# EAGLE design interface_board (EAGLE 8.1.1)

## Sheet 1 of 2
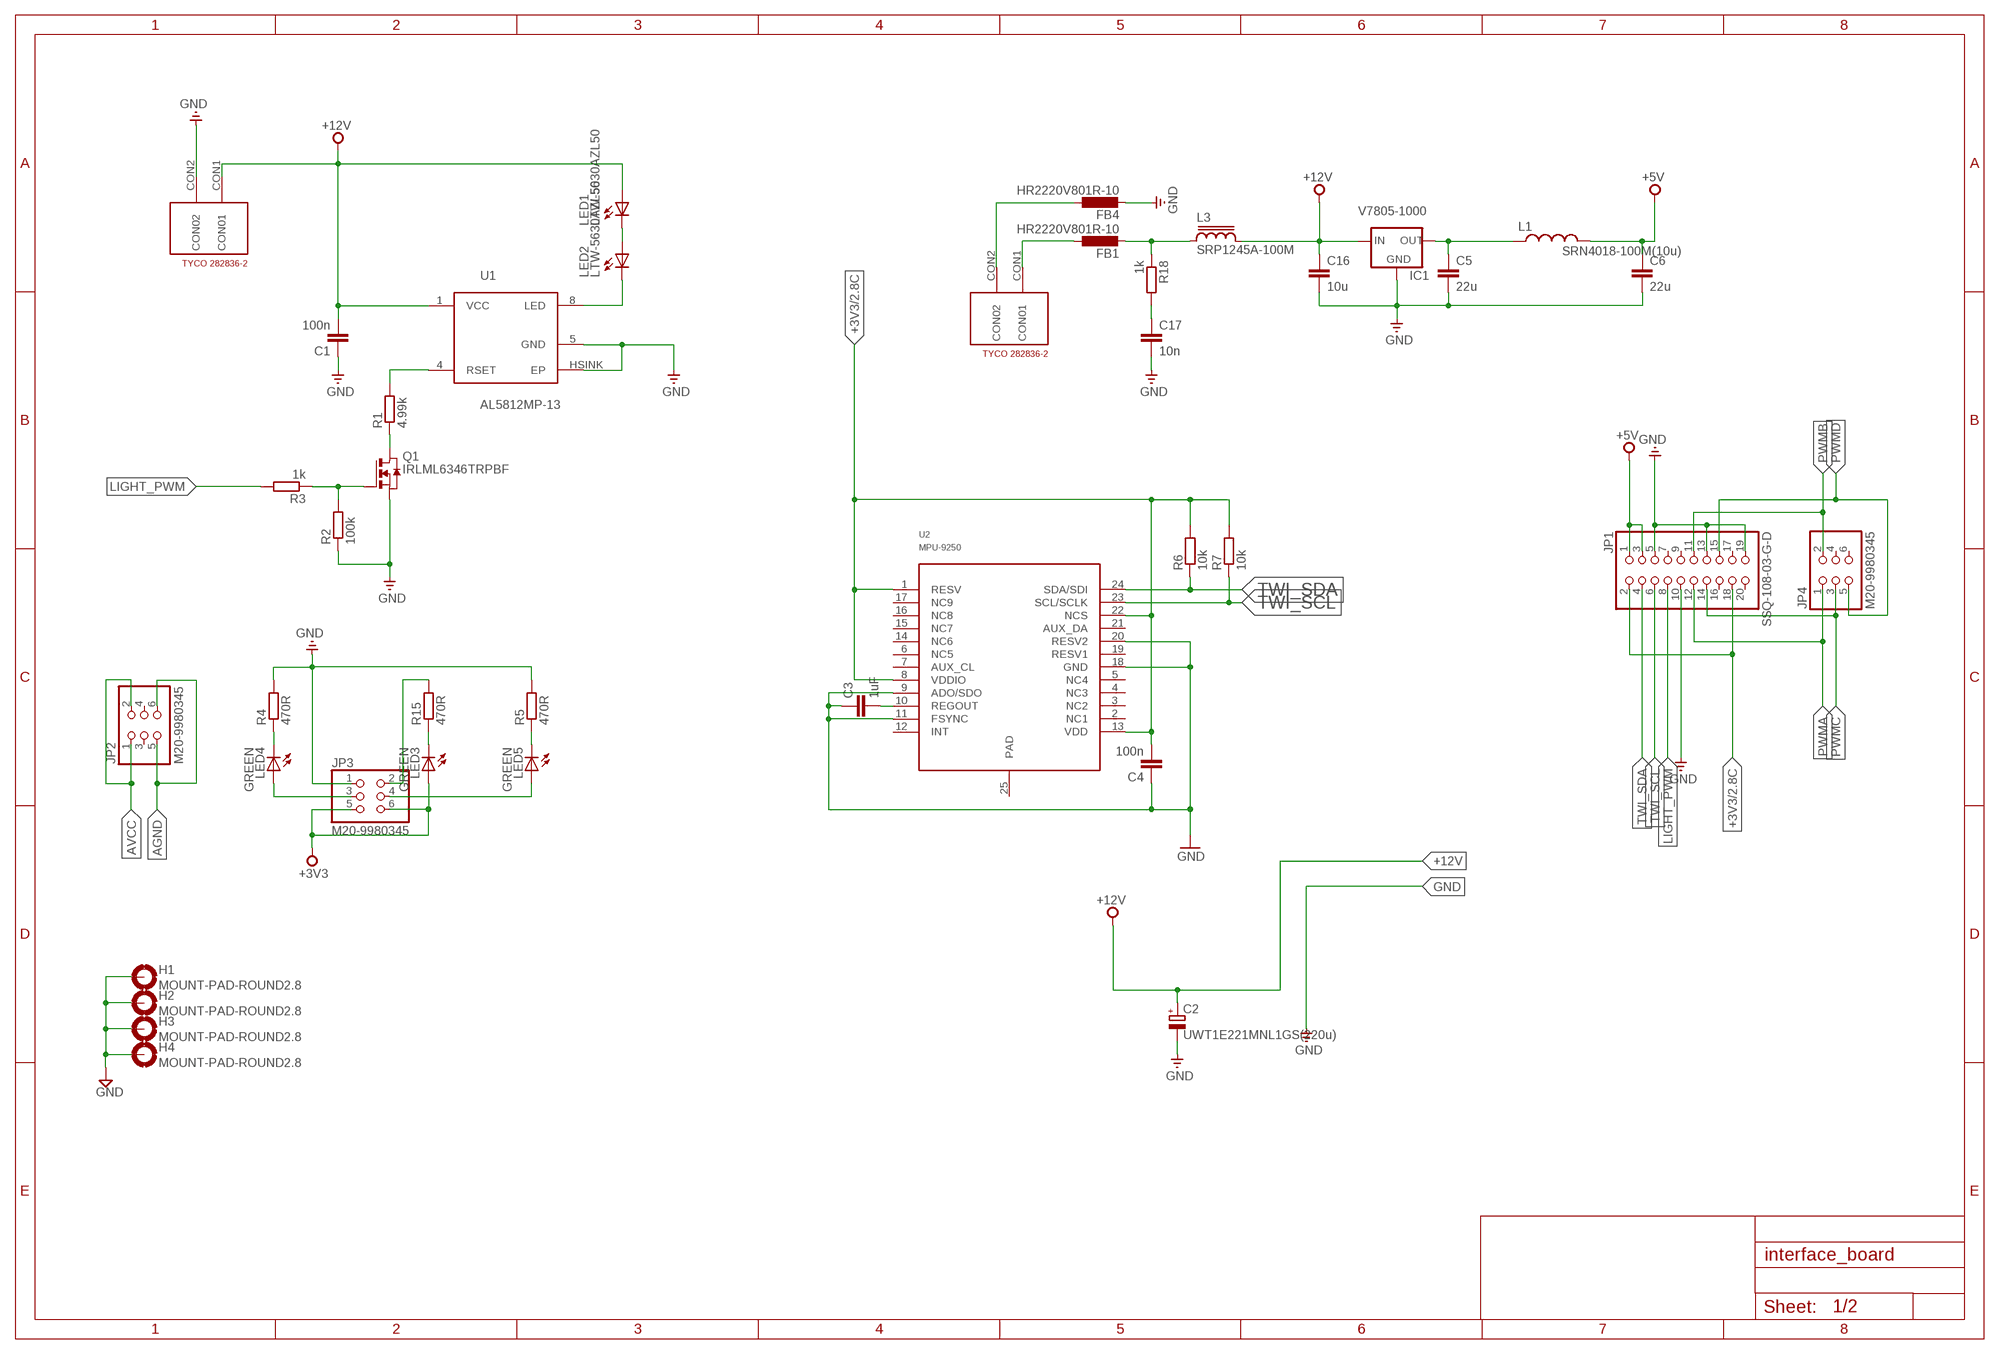
[diagram p0: schematic, sheet 1]

### Parts
C1  100n  C-EUC0402  [C0402]
C2  UWT1E221MNL1GS(220u)  CPOL-EU153CLV-0810  [153CLV-0810]
C3  1uF  C-EUC0402  [C0402]
C4  100n  C-EUC0402  [C0402]
C5  22u  C-EUC0603  [C0603]
C6  22u  C-EUC0603  [C0603]
C16  10u  C-EUC0603  [C0603]
C17  10n  C-EUC0402  [C0402]
FB1  HR2220V801R-10  L-EUL5650M  [L5650M]
FB4  HR2220V801R-10  L-EUL5650M  [L5650M]
H1  MOUNT-PAD-ROUND2.8  [2,8-PAD]
H2  MOUNT-PAD-ROUND2.8  [2,8-PAD]
H3  MOUNT-PAD-ROUND2.8  [2,8-PAD]
H4  MOUNT-PAD-ROUND2.8  [2,8-PAD]
IC1  V7805-1000  VR_1OUTXX  [DIP_3PIN]
JP1  SSQ-108-03-G-D  PINHD-2X10  [2X10]
JP2  M20-9980345  PINHD-2X3  [2X03]
JP3  M20-9980345  PINHD-2X3  [2X03]
JP4  M20-9980345  PINHD-2X3  [2X03]
L1  SRN4018-100M(10u)  BOURNS-SRN4018  [BOURNS-SRN4018]
L3  SRP1245A-100M  SRP1250A  [SRP1250A]
LED1  LTW-5630AZL50  LTW-5630AZL  [LITEON-5630]
LED2  LTW-5630AZL50  LTW-5630AZL  [LITEON-5630]
LED3  GREEN  LEDCHIP-LED0603  [CHIP-LED0603]
LED4  GREEN  LEDCHIP-LED0603  [CHIP-LED0603]
LED5  GREEN  LEDCHIP-LED0603  [CHIP-LED0603]
Q1  IRLML6346TRPBF  NMOS-FETSOT23  [SOT23]
R1  4.99k  R-EU_R0402  [R0402]
R2  100k  R-EU_R0402  [R0402]
R3  1k  R-EU_R0402  [R0402]
R4  470R  R-EU_R0402  [R0402]
R5  470R  R-EU_R0402  [R0402]
R6  10k  R-EU_R0402  [R0402]
R7  10k  R-EU_R0402  [R0402]
R15  470R  R-EU_R0402  [R0402]
R18  1k  R-EU_R0402  [R0402]
U1  AL5812MP-13  [MSOP-8EP]
U2  MPU-9250  [LEAD-QFN24]
U$2  282836-2  [282836-2]
U$4  282836-2  [282836-2]

### Nets
+3V3: C4.2 JP1.2 JP1.18 JP3.5 JP3.6 LED3.A R6.2 R7.2 U2.1(RESV) U2.8(VDDIO) U2.13(VDD) U2.22(NCS) ; also sheet 2
+5V [VCC]: C6.1 JP1.1 JP1.3 L1.P$1 ; also sheet 2
+12V [VCC]: C1.2 C2.+ C16.1 IC1.IN L3.2 LED1.A1(A) LED1.A2(A) LED1.A3(A) U1.1(VCC) U$4.CON1(CON01)
AGND [GND]: FB4.1 JP2.5 JP2.6 U$2.CON2(CON02)
AVCC: FB1.1 JP2.1 JP2.2 U$2.CON1(CON01)
GND [GND]: C1.1 C2.- C3.1 C4.1 C5.2 C6.2 C16.2 C17.2 FB4.2 H1.B2,8(MOUNT) H2.B2,8(MOUNT) H3.B2,8(MOUNT) H4.B2,8(MOUNT) IC1.GND JP1.5 JP1.10 JP1.13 JP1.19 JP3.1 Q1.2(S) R2.1 R4.2 R5.2 U1.5(GND) U1.HSINK(EP) U2.9(ADO/SDO) U2.11(FSYNC) U2.18(GND) U2.20(RESV2) U$4.CON2(CON02) ; also sheet 2
LIGHT_PWM: JP1.8 R3.2
N$1: LED1.C1(C) LED1.C2(C) LED2.A1(A) LED2.A2(A) LED2.A3(A)
N$2: LED4.C R4.1
N$3 [VCC]: FB1.2 L3.1 R18.1
N$4: C3.2 U2.10(REGOUT)
N$5: R1.2 U1.4(RSET)
N$6: Q1.3(D) R1.1
N$7: Q1.1(G) R2.2 R3.1
N$8: JP3.3 LED4.A
N$9: LED2.C1(C) LED2.C2(C) U1.8(LED)
N$10 [VCC]: C5.1 IC1.OUT L1.P$2
N$11: JP3.4 LED5.A
N$12: LED5.C R5.1
N$13 [GND]: JP3.2 R15.2
N$14: LED3.C R15.1
N$38: C17.1 R18.2
PWMA: JP1.12 JP4.1
PWMB: JP1.11 JP4.2
PWMC: JP1.14 JP4.3
PWMD: JP1.15 JP4.5
TWI_SCL: JP1.6 R7.1 U2.23(SCL/SCLK)
TWI_SDA: JP1.4 R6.1 U2.24(SDA/SDI)
Unconnected: JP1.7 JP1.9 JP1.16 JP1.17 JP1.20 JP2.3 JP2.4 JP4.4 JP4.6 U2.2(NC1) U2.3(NC2) U2.4(NC3) U2.5(NC4) U2.6(NC5) U2.7(AUX_CL) U2.12(INT) U2.14(NC6) U2.15(NC7) U2.16(NC8) U2.17(NC9) U2.19(RESV1) U2.21(AUX_DA) U2.25(PAD)

### Notes on the sheet
- Hole

## Sheet 2 of 2
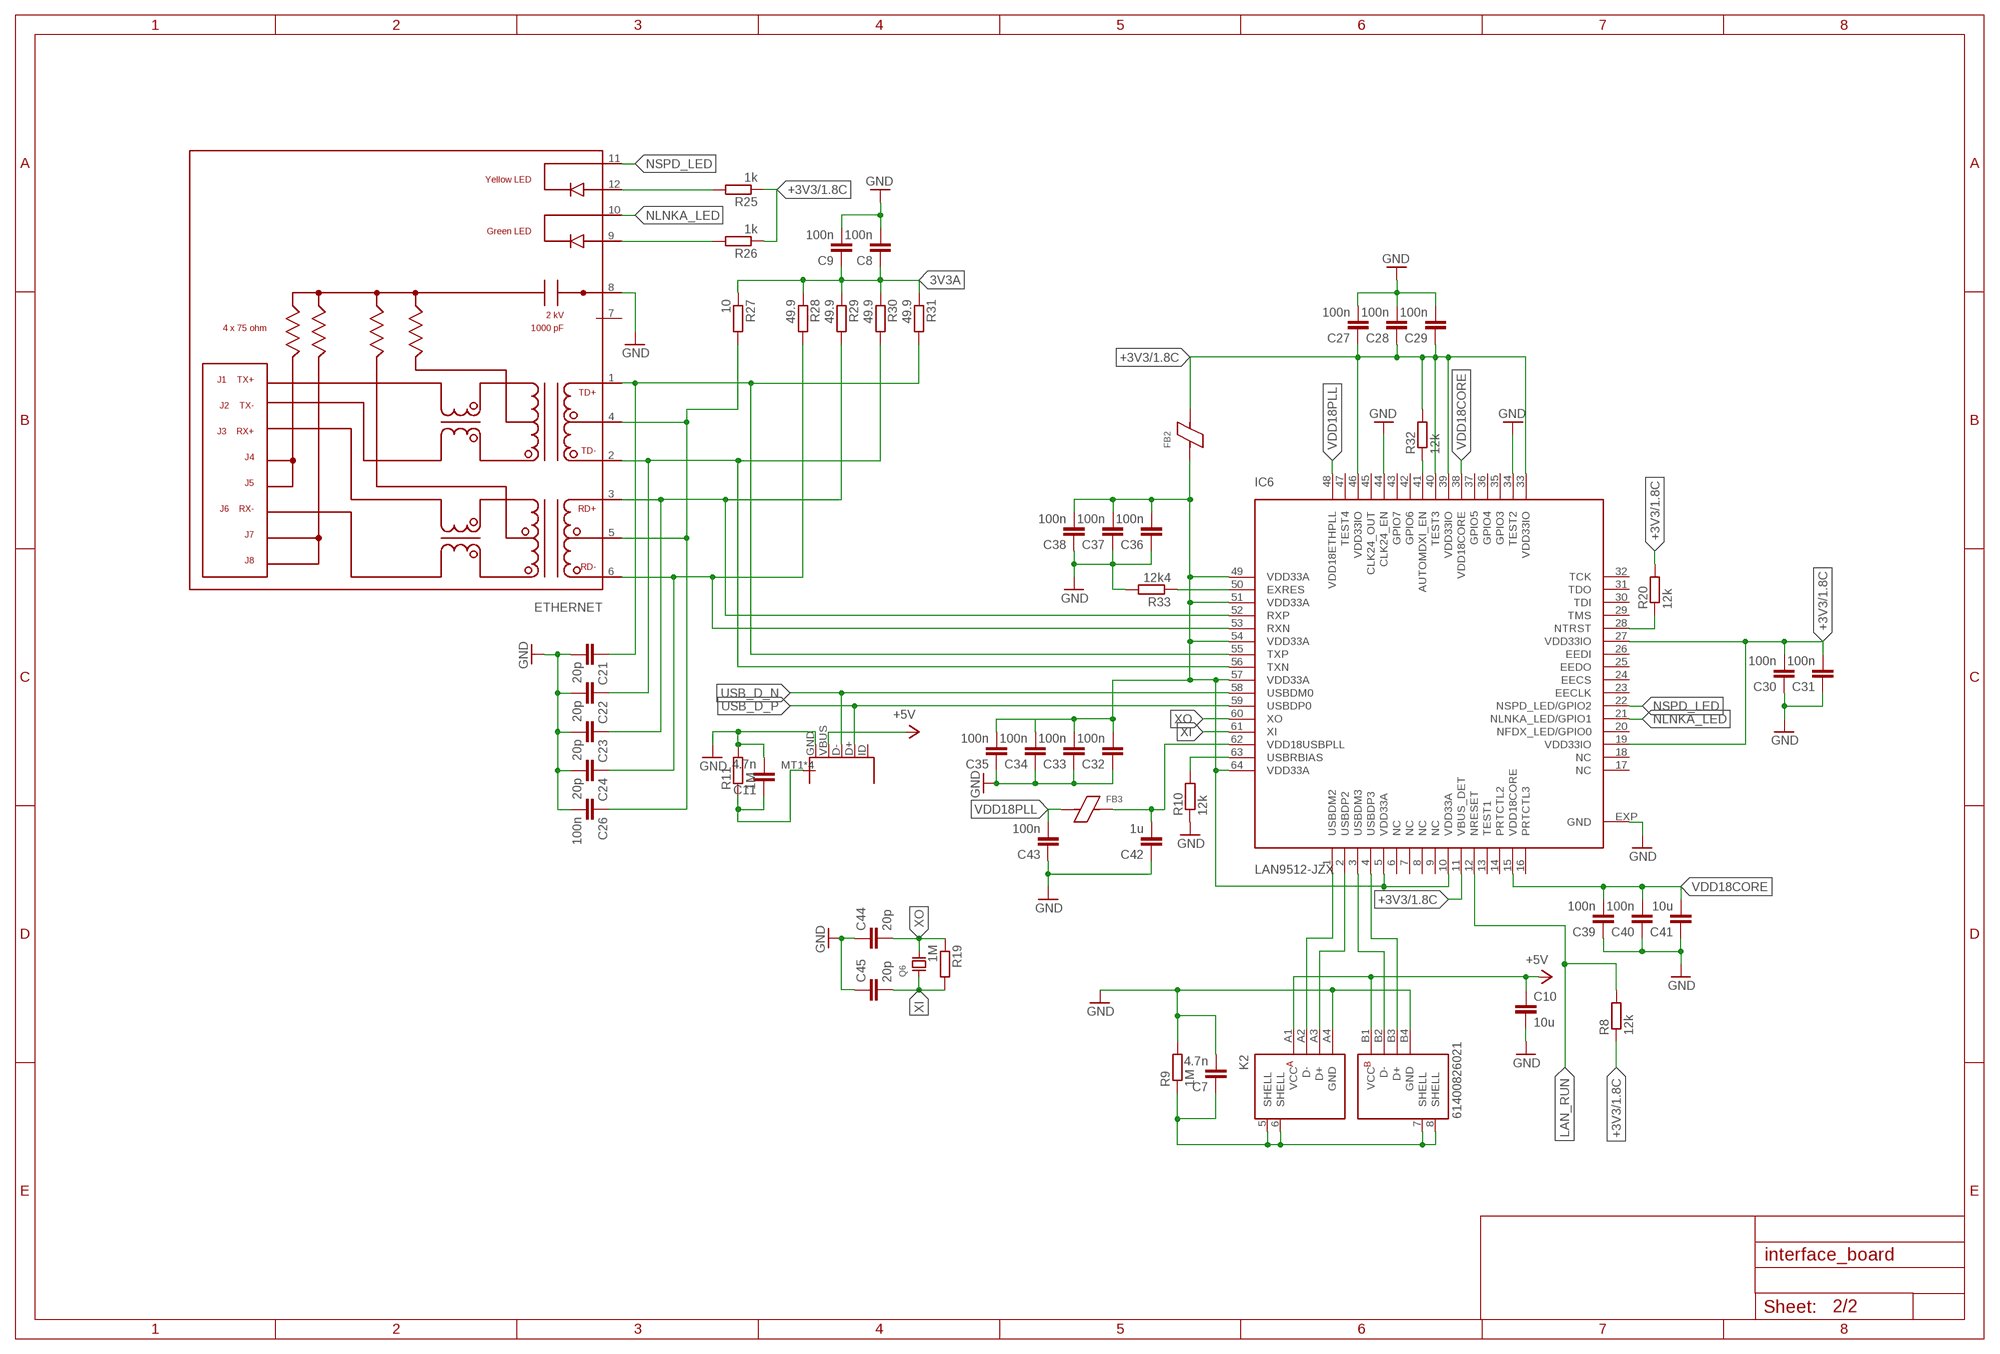
[diagram p1: schematic, sheet 2]

### Parts
C7  4.7n  C-EUC0402  [C0402]
C8  100n  C-EUC0402  [C0402]
C9  100n  C-EUC0402  [C0402]
C10  10u  C-EUC0603  [C0603]
C11  4.7n  C-EUC0402  [C0402]
C21  20p  C-EUC0402  [C0402]
C22  20p  C-EUC0402  [C0402]
C23  20p  C-EUC0402  [C0402]
C24  20p  C-EUC0402  [C0402]
C26  100n  C-EUC0402  [C0402]
C27  100n  C-EUC0402  [C0402]
C28  100n  C-EUC0402  [C0402]
C29  100n  C-EUC0402  [C0402]
C30  100n  C-EUC0402  [C0402]
C31  100n  C-EUC0402  [C0402]
C32  100n  C-EUC0402  [C0402]
C33  100n  C-EUC0402  [C0402]
C34  100n  C-EUC0402  [C0402]
C35  100n  C-EUC0402  [C0402]
C36  100n  C-EUC0402  [C0402]
C37  100n  C-EUC0402  [C0402]
C38  100n  C-EUC0402  [C0402]
C39  100n  C-EUC0402  [C0402]
C40  100n  C-EUC0402  [C0402]
C41  10u  C-EUC0603  [C0603]
C42  1u  C-EUC0402  [C0402]
C43  100n  C-EUC0402  [C0402]
C44  20p  C-EUC0402  [C0402]
C45  20p  C-EUC0402  [C0402]
ETHERNET  HR911105A  [RJ45]
FB2  742792022  FERRITE_BEAD  [C0805]
FB3  742792022  FERRITE_BEAD  [C0805]
IC6  LAN9512-JZX  LAN9512  [QFN64-9X9]
JP6  10118192-0001LF  USB-IDMICRO  [USB-MICRO]
K2  61400826021  [61400826021]
Q6  FA-238 25.0000MB  CTS_32X25_SMD  [CTS_32X25]
R8  12k  R-EU_R0402  [R0402]
R9  1M  R-EU_R0402  [R0402]
R10  12k  R-EU_R0402  [R0402]
R11  1M  R-EU_R0402  [R0402]
R19  1M  R-EU_R0402  [R0402]
R20  12k  R-EU_R0402  [R0402]
R25  1k  R-EU_R0402  [R0402]
R26  1k  R-EU_R0402  [R0402]
R27  10  R-EU_R0402  [R0402]
R28  49.9  R-EU_R0402  [R0402]
R29  49.9  R-EU_R0402  [R0402]
R30  49.9  R-EU_R0402  [R0402]
R31  49.9  R-EU_R0402  [R0402]
R32  12k  R-EU_R0402  [R0402]
R33  12k4  R-EU_R0402  [R0402]

### Nets
3V3A: C8.1 C9.1 C32.2 C33.2 C34.2 C35.2 C36.2 C37.2 C38.2 FB2.1 IC6.5(VDD33A) IC6.10(VDD33A) IC6.49(VDD33A) IC6.51(VDD33A) IC6.54(VDD33A) IC6.57(VDD33A) IC6.64(VDD33A) R27.1 R28.1 R29.1 R30.1 R31.1
+3V3: C27.1 C28.1 C29.1 C30.2 C31.2 FB2.2 IC6.11(VBUS_DET) IC6.19(VDD33IO) IC6.27(VDD33IO) IC6.33(VDD33IO) IC6.39(VDD33IO) IC6.40(TEST3) IC6.46(VDD33IO) R8.1 R20.2 R25.1 R26.1 R32.2 ; also sheet 1
+5V [VCC]: C10.1 JP6.VBUS K2.A1(VCC) K2.B1(VCC) ; also sheet 1
AVDD18PLL: C42.2 FB3.2 IC6.62(VDD18USBPLL)
GND [GND]: C7.2 C8.2 C9.2 C10.2 C11.2 C21.2 C22.2 C23.2 C24.2 C26.2 C27.2 C28.2 C29.2 C30.1 C31.1 C32.1 C33.1 C34.1 C35.1 C36.1 C37.1 C38.1 C39.1 C40.1 C41.1 C42.1 C43.1 C44.1 C45.1 ETHERNET.8 IC6.34(TEST2) IC6.44(CLK24_EN) IC6.EXP(GND) JP6.GND K2.A4(GND) K2.B4(GND) R9.2 R10.1 R11.2 R33.2 ; also sheet 1
LAN_RUN: IC6.12(NRESET) R8.2
N$37: ETHERNET.12 R25.2
N$40: ETHERNET.9 R26.2
N$41: C26.1 ETHERNET.4 ETHERNET.5 R27.2
N$42: IC6.63(USBRBIAS) R10.2
N$44: IC6.41(AUTOMDXI_EN) R32.1
N$45: IC6.50(EXRES) R33.1
N$46: IC6.28(NTRST) R20.1
NLNKA_LED: ETHERNET.10 IC6.21(NLNKA_LED/GPIO1)
NSPD_LED: ETHERNET.11 IC6.22(NSPD_LED/GPIO2)
RX_N [100ohm_differencial_pair]: C24.1 ETHERNET.6 IC6.53(RXN) R28.2
RX_P [100ohm_differencial_pair]: C23.1 ETHERNET.3 IC6.52(RXP) R29.2
TX_N [100ohm_differencial_pair]: C22.1 ETHERNET.2 IC6.56(TXN) R30.2
TX_P [100ohm_differencial_pair]: C21.1 ETHERNET.1 IC6.55(TXP) R31.2
USB1_SHELL [GND]: C7.1 K2.5(SHELL) K2.6(SHELL) K2.7(SHELL) K2.8(SHELL) R9.1
USB2_SHELL [GND]: C11.1 JP6.MT1(SHELL) JP6.MT2(SHELL) JP6.P$1(SHELL) JP6.P$2(SHELL) R11.1
USB_D_N [90ohm_differencial_pair]: IC6.58(USBDM0) JP6.D-
USB_D_P [90ohm_differencial_pair]: IC6.59(USBDP0) JP6.D+
USBD2_N [90ohm_differencial_pair]: IC6.1(USBDM2) K2.A2(D-)
USBD2_P [90ohm_differencial_pair]: IC6.2(USBDP2) K2.A3(D+)
USBD3_N [90ohm_differencial_pair]: IC6.3(USBDM3) K2.B2(D-)
USBD3_P [90ohm_differencial_pair]: IC6.4(USBDP3) K2.B3(D+)
VDD18CORE: C39.2 C40.2 C41.2 IC6.15(VDD18CORE) IC6.38(VDD18CORE)
VDD18PLL: C43.2 FB3.1 IC6.48(VDD18ETHPLL)
XI: C45.2 IC6.61(XI) Q6.1(X1) R19.2
XO: C44.2 IC6.60(XO) Q6.3(X2) R19.1
Unconnected: ETHERNET.7 IC6.6(NC) IC6.7(NC) IC6.8(NC) IC6.9(NC) IC6.13(TEST1) IC6.14(PRTCTL2) IC6.16(PRTCTL3) IC6.17(NC) IC6.18(NC) IC6.20(NFDX_LED/GPIO0) IC6.23(EECLK) IC6.24(EECS) IC6.25(EEDO) IC6.26(EEDI) IC6.29(TMS) IC6.30(TDI) IC6.31(TDO) IC6.32(TCK) IC6.35(GPIO3) IC6.36(GPIO4) IC6.37(GPIO5) IC6.42(GPIO6) IC6.43(GPIO7) IC6.45(CLK24_OUT) IC6.47(TEST4) JP6.ID

## Library data of the parts
C1 C3-C11 C16 C17 C21-C24 C26-C45 = resistor:C-EU: CAPACITOR, European symbol
C2 = resistor:CPOL-EU: POLARIZED CAPACITOR, European symbol
ETHERNET = hanrun:HR911105A: Low cost RJ45 connector with integrated magnetics and LEDs. www.hasseb.fi
FB1 FB4 = resistor:L-EU: INDUCTOR, European symbol
FB2 FB3 = raspi:FERRITE_BEAD
H1-H4 = holes:MOUNT-PAD-ROUND: MOUNTING PAD, round
IC1 = openblw:VR_1OUT: VOLTAGE REGULATOR
IC6 = raspi:LAN9512
JP1 = pinhead:PINHD-2X10: PIN HEADER
JP2-JP4 = pinhead:PINHD-2X3: PIN HEADER
JP6 = openblw:USB-ID; PROD_ID: CONN-09505
K2 = openblw:61400826021: WR-COM Horizontal Dual Stacked USB Type A
L1 = openblw:BOURNS-SRN4018
L3 = openblw:SRP1250A: POWER INDUCTOR
LED1 LED2 = openblw:LTW-5630AZL: Lite-On 5x3 mm LTW-5630AZL White LED
LED3-LED5 = led:LED: LED OSRAM: - CHIPLED LG R971, LG N971, LY N971, LG Q971, LY Q971, LO R971, LY R971 LH N974, LH R974 LS Q976, LO Q976, LY Q976 LO Q996 - Hyper CHIPLED LW Q18S LB Q993, LB Q99A, LB R99A - SideLED LS A670, LO A670, LY A670, LG A670, LP A670 LB A673, LV A673, LT A673, LW A673 LH A674 LY A675 LS A676, LA A676, LO A676, LY A676, LW A676 LS A679, LY A679, LG A679 - Hyper Micro SIDELED® LS Y876, LA Y876, LO Y876, LY Y876 LT Y87S - SmartLED LW L88C, LW L88S LB L89C, LB L89S, LG L890 LS L89K, LO L89K, LY L89K LS L896, LA L896, LO L896, LY L896 - TOPLED LS T670, LO T670, LY T670, LG T670, LP T670 LSG T670, LSP T670, LSY T670, LOP T670, LYG T670 LG T671, LOG T671, LSG T671 LB T673, LV T673, LT T673, LW T673 LH T674 LS T676, LA T676, LO T676, LY T676, LB T676, LH T676, LSB T676, LW T676 LB T67C, LV T67C, LT T67C, LS T67K, LO T67K, LY T67K, LW E67C LS E67B, LA E67B, LO E67B, LY E67B, LB E67C, LV E67C, LT E67C LW T67C LS T679, LY T679, LG T679 LS T770, LO T770, LY T770, LG T770, LP T770 LB T773, LV T773, LT T773, LW T773 LH T774 LS E675, LA E675, LY E675, LS T675 LS T776, LA T776, LO T776, LY T776, LB T776 LHGB T686 LT T68C, LB T68C - Hyper Mini TOPLED® LB M676 - Mini TOPLED Santana® LG M470 LS M47K, LO M47K, LY M47K Source: http://www.osram.convergy.de LUXEON: - LUMILED® LXK2-PW12-R00, LXK2-PW12-S00, LXK2-PW14-U00, LXK2-PW14-V00 LXK2-PM12-R00, LXK2-PM12-S00, LXK2-PM14-U00 LXK2-PE12-Q00, LXK2-PE12-R00, LXK2-PE12-S00, LXK2-PE14-T00, LXK2-PE14-U00 LXK2-PB12-K00, LXK2-PB12-L00, LXK2-PB12-M00, LXK2-PB14-N00, LXK2-PB14-P00, LXK2-PB14-Q00 LXK2-PR12-L00, LXK2-PR12-M00, LXK2-PR14-Q00, LXK2-PR14-R00 LXK2-PD12-Q00, LXK2-PD12-R00, LXK2-PD12-S00 LXK2-PH12-R00, LXK2-PH12-S00 LXK2-PL12-P00, LXK2-PL12-Q00, LXK2-PL12-R00 Source: www.luxeon.com KINGBRIGHT: KA-3528ASYC Source: www.kingbright.com
Q1 = openblw:NMOS-FET: Generic NMOS FET
Q6 = raspi:CTS_32X25_SMD
R1-R11 R15 R18-R20 R25-R33 = resistor:R-EU_: RESISTOR, European symbol
U1 = openblw:AL5812: Diodes, Inc AL5812 LED Driver
U2 = invensense:MPU-9250
U$2 U$4 = openblw:282836-2: TYCO 282836-2 TERM BLOCK 2POS SIDE ENTRY 5MM EURISTYLE

## Net classes
1 GND: width 0.508 mm, drill 0.3 mm, clearance 0.2 mm to class 0, clearance 0.2 mm
2 100ohm_differencial_pair: width 0.254 mm, drill 0.3 mm, clearance 0.5 mm to class 0, clearance 0.5 mm to class 1, clearance 0.25 mm
3 90ohm_differencial_pair: width 0.254 mm, drill 0.3 mm, clearance 0.5 mm to class 0, clearance 0.5 mm to class 1, clearance 0.5 mm to class 2, clearance 0.15 mm
5 VCC: width 0.508 mm, drill 0.3 mm, clearance 0.3 mm to class 0, clearance 0.3 mm to class 1, clearance 0.5 mm to class 2, clearance 0.5 mm to class 3, clearance 0.5 mm to class 4, clearance 0.3 mm

## Board
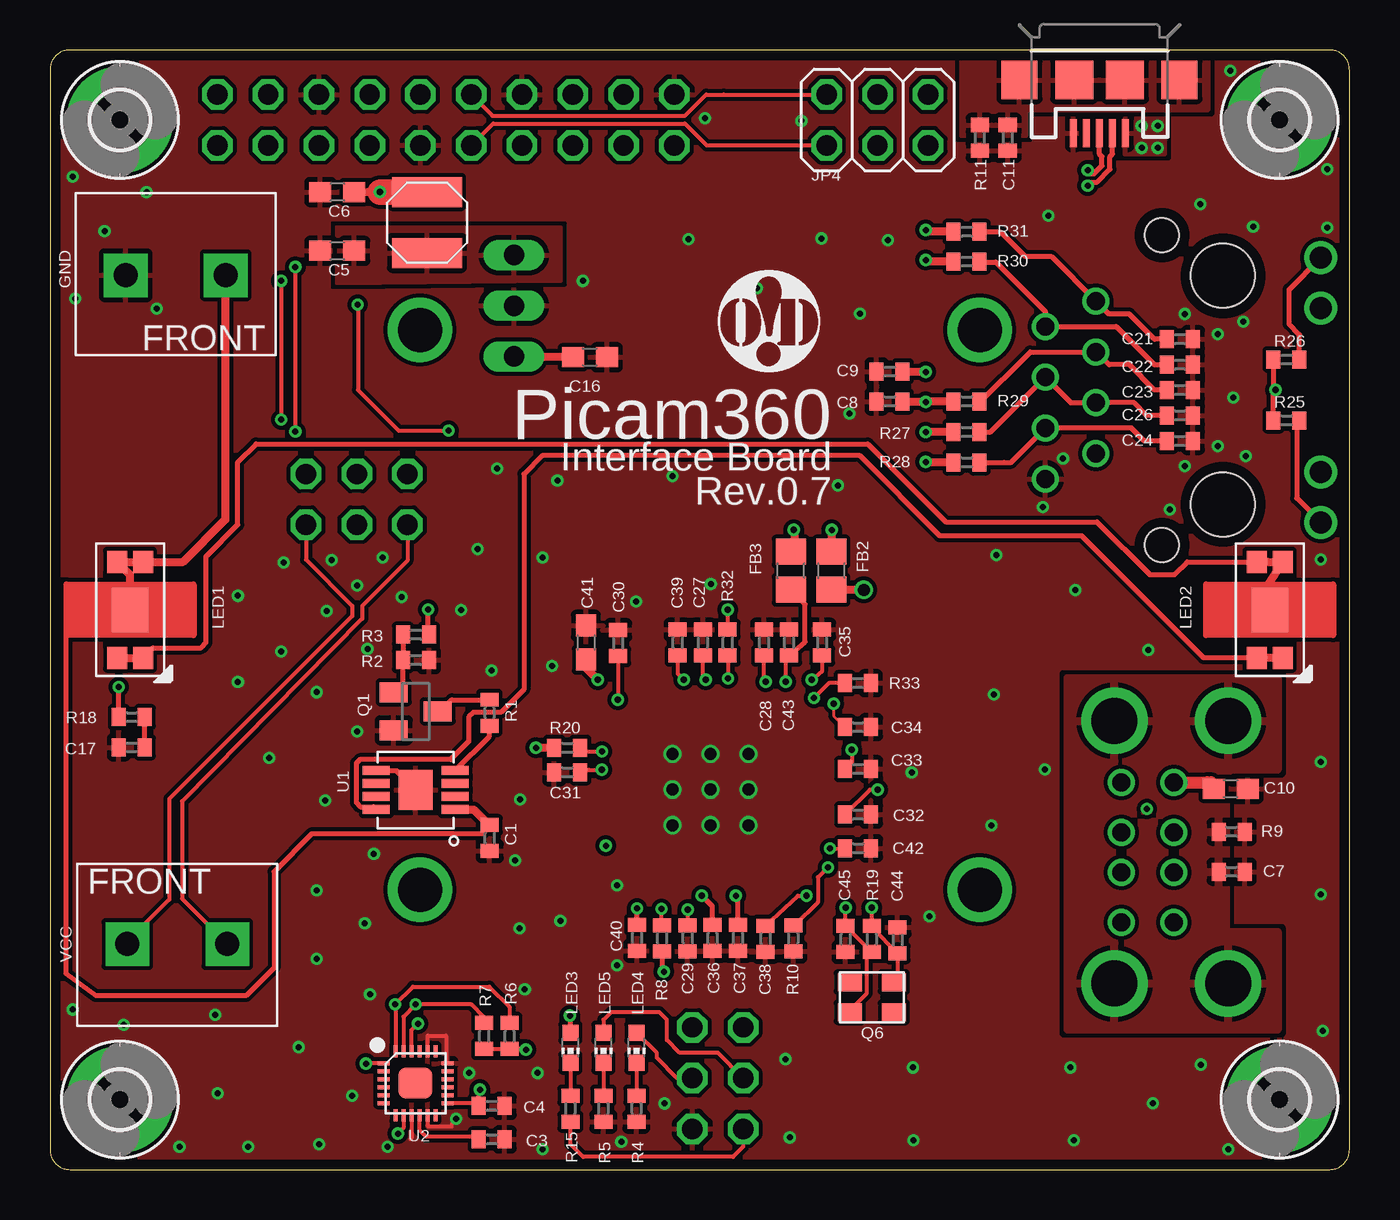
[diagram p2: board, top side]
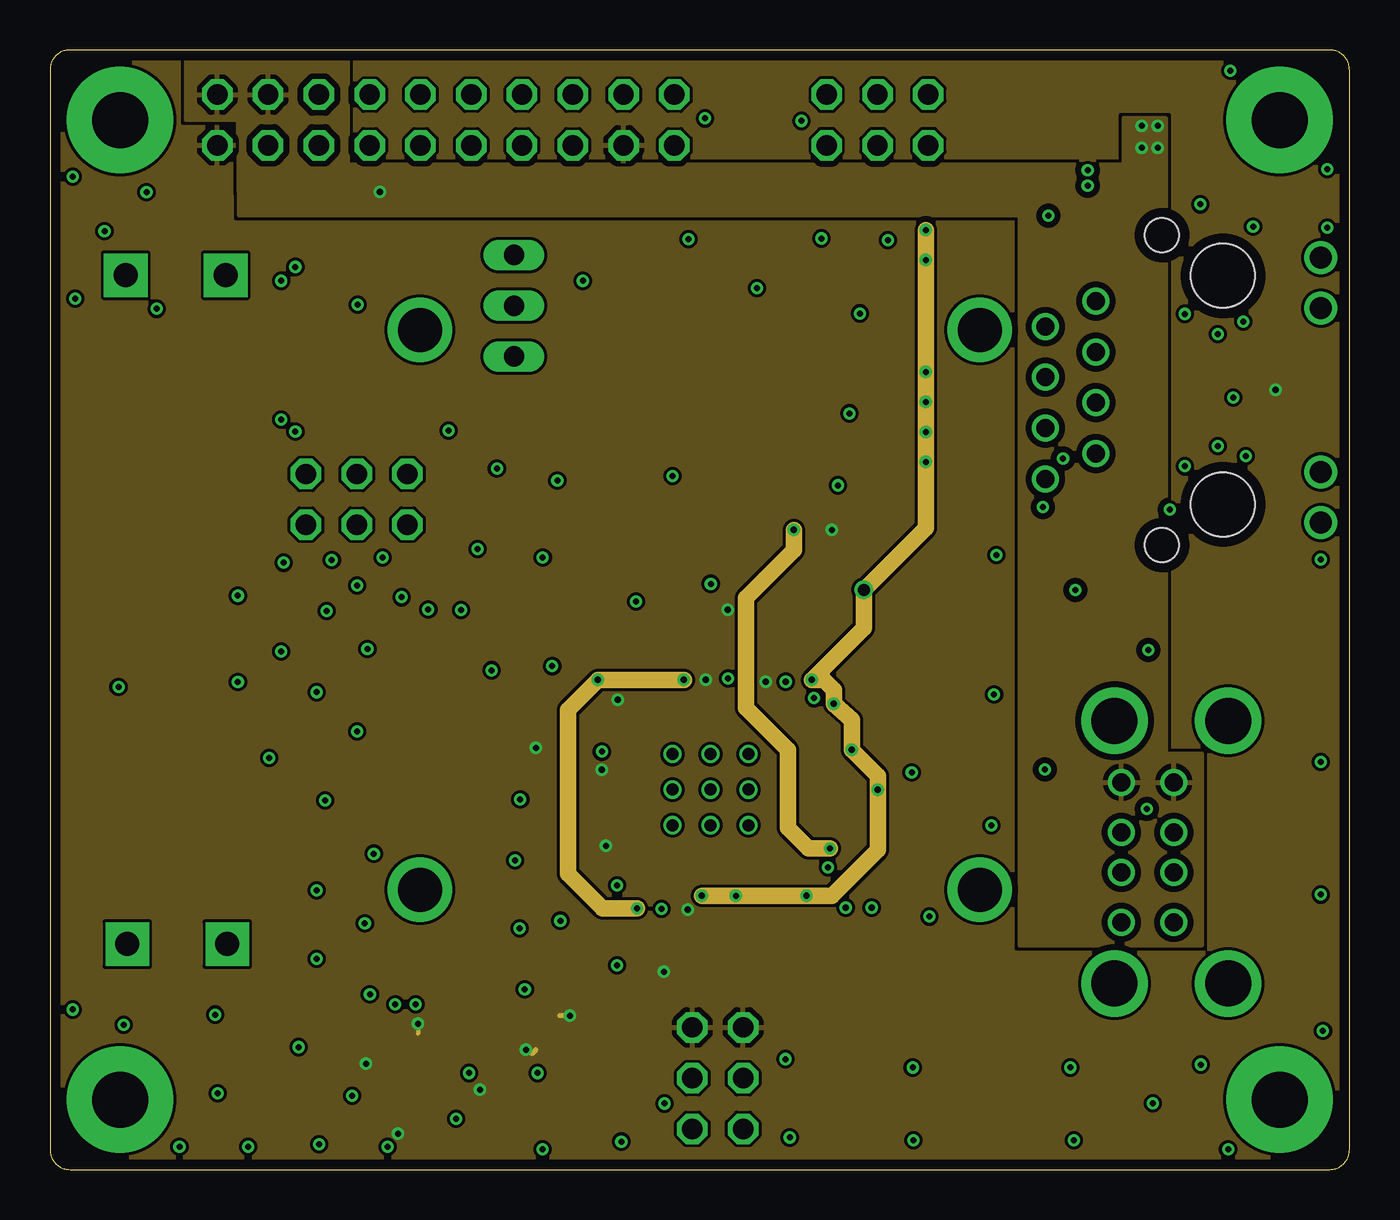
[diagram p3: board, inner layer Route2]
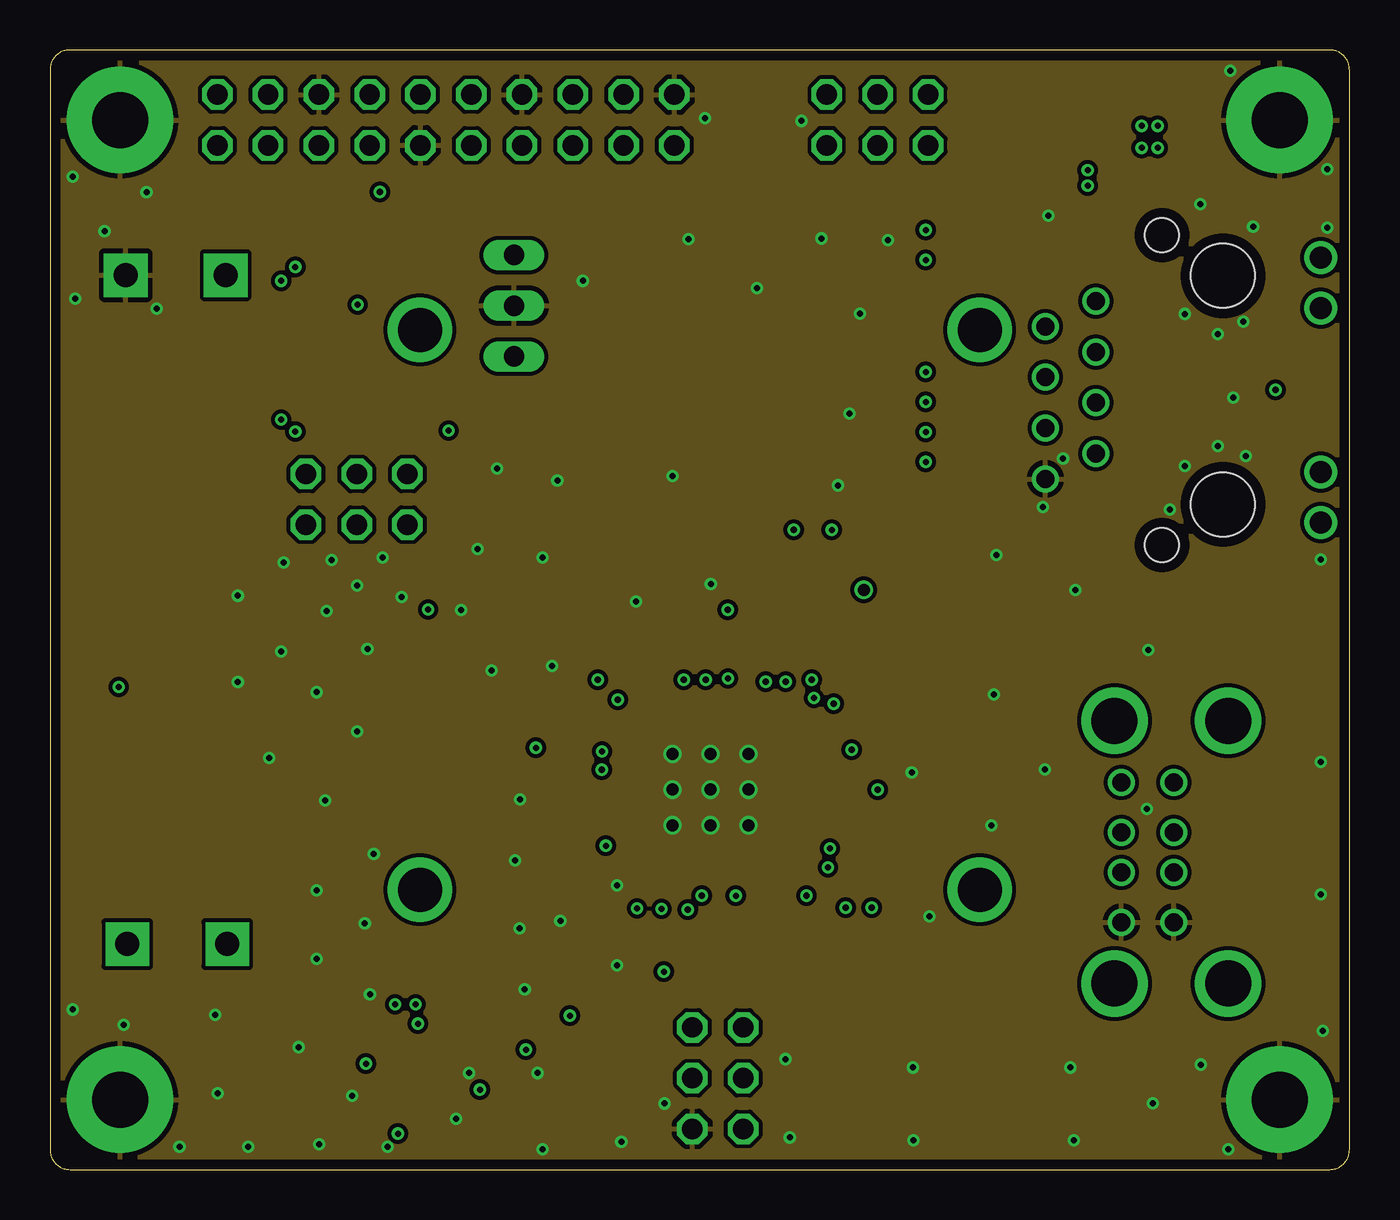
[diagram p4: board, inner layer Route15]
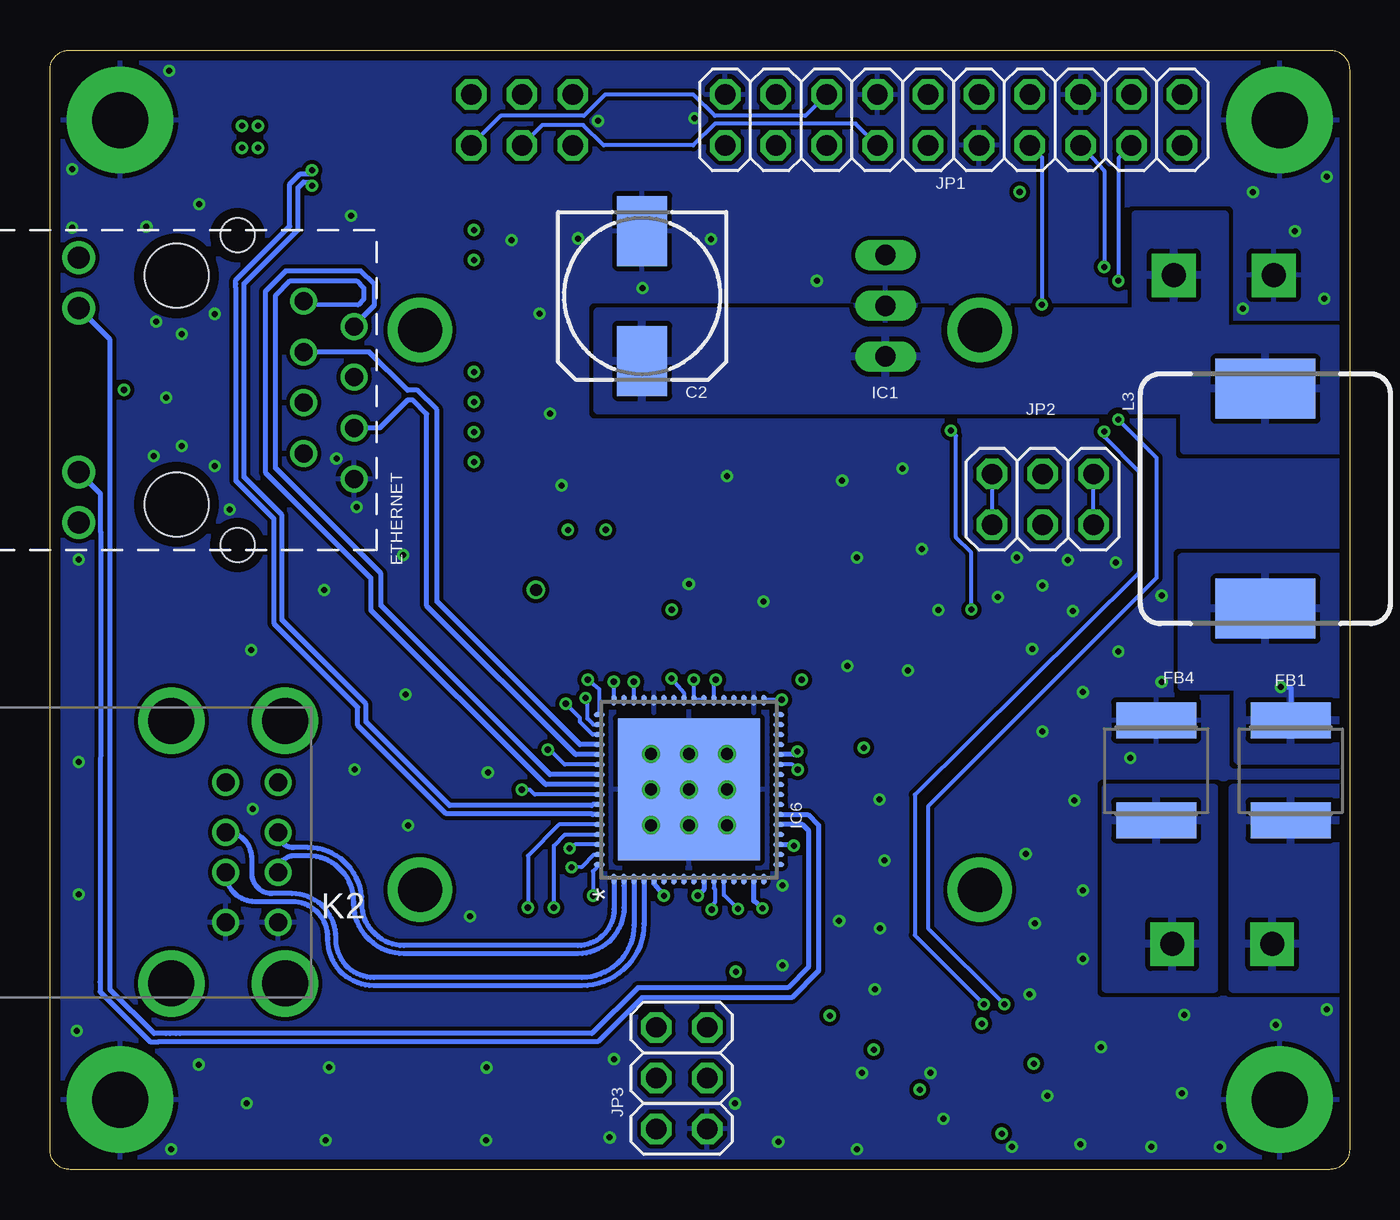
[diagram p5: board, bottom side, seen from below]

Size 65 x 56 mm. Coordinates in mm from the lower left corner, seen from the top.
Outline: 64.06,0 64.12,0.01 64.19,0.02 64.25,0.03 64.31,0.05 64.37,0.07 64.43,0.1 64.48,0.12 64.54,0.16 64.59,0.19 64.64,0.23 64.68,0.27 64.73,0.32 64.77,0.36 64.81,0.41 64.84,0.46 64.88,0.52 64.91,0.57 64.93,0.63 64.95,0.69 64.97,0.75 64.98,0.81 64.99,0.88 65,0.94 65,1 65,55 65,55.06 64.99,55.12 64.98,55.19 64.97,55.25 64.95,55.31 64.93,55.37 64.91,55.43 64.88,55.48 64.84,55.54 64.81,55.59 64.77,55.64 64.73,55.68 64.68,55.73 64.64,55.77 64.59,55.81 64.54,55.84 64.48,55.88 64.43,55.91 64.37,55.93 64.31,55.95 64.25,55.97 64.19,55.98 64.12,55.99 64.06,56 64,56 1,56 0.94,56 0.88,55.99 0.81,55.98 0.75,55.97 0.69,55.95 0.63,55.93 0.57,55.91 0.52,55.88 0.46,55.84 0.41,55.81 0.36,55.77 0.32,55.73 0.27,55.68 0.23,55.64 0.19,55.59 0.16,55.54 0.12,55.48 0.1,55.43 0.07,55.37 0.05,55.31 0.03,55.25 0.02,55.19 0.01,55.12 0,55.06 0,55 0,1 0,0.94 0.01,0.88 0.02,0.81 0.03,0.75 0.05,0.69 0.07,0.63 0.1,0.57 0.12,0.52 0.16,0.46 0.19,0.41 0.23,0.36 0.27,0.32 0.32,0.27 0.36,0.23 0.41,0.19 0.46,0.16 0.52,0.12 0.57,0.1 0.63,0.07 0.69,0.05 0.75,0.03 0.81,0.02 0.88,0.01 0.94,0 1,0 64,0 64.06,0
Copper layers (1*2*15*16): Top 0.035mm / dielectric 0.2mm / Route2 0.035mm / dielectric 1.2mm / Route15 0.035mm / dielectric 0.2mm / Bottom 0.035mm
Design rules "Elecrow_4-layer_PCB_eagle_rule *": minimum track width 6mil, minimum drill 0.3mm, track to track 6mil, track to pad 6mil, pad to pad 6mil, via to via 8mil, smd to smd 0mil, copper to edge 20mil, drill to drill 10mil, minimum pad ring 6mil, minimum via ring 6mil, stop-mask expansion 0mil, vias tented up to drill 100mil, thermal gap 10mil

### Footprints (pad centres in the part's own frame; a part is rotated, then mirrored left to right if it is on the bottom)
C0402 = smd 0.7 x 0.9: 1 -0.65,0; 2 0.65,0
153CLV-0810 = smd 3.5 x 2.5: + 3.25,0; - -3.25,0
C0603 = smd 1.1 x 1: 1 -0.85,0; 2 0.85,0
RJ45 = drill 0.9: 1 4.45,-6.35; 2 3.18,-8.89; 3 1.91,-6.35; 4 0.64,-8.89; 5 -0.63,-6.35; 6 -1.9,-8.89; 7 -3.17,-6.35; 8 -4.44,-8.89 | drill 1.1: 9 6.63,4.9; 10 4.09,4.9; 11 -4.09,4.9; 12 -6.63,4.9 | hole 3.2: 5.715,0; -5.715,0 | hole 1.7: -7.75,-3.05; 7.75,-3.05
L5650M = smd 1.8 x 4: 1 -2.5,0; 2 2.5,0
C0805 = smd 1.3 x 1.5: 1 -0.95,0; 2 0.95,0
2,8-PAD = drill 2.8 pad 5.334: B2,8 0,0
DIP_3PIN = drill 1.016 long: GND 0,-2.54; IN -2.54,-2.54; OUT 2.54,-2.54
QFN64-9X9 = smd 0.55 x 0.25: 1 -4.477,3.75; 2 -4.477,3.25; 3 -4.477,2.75; 4 -4.477,2.25; 5 -4.477,1.75; 6 -4.477,1.25; 7 -4.477,0.75; 8 -4.477,0.25; 9 -4.477,-0.25; 10 -4.477,-0.75; 11 -4.477,-1.25; 12 -4.477,-1.75; 13 -4.477,-2.25; 14 -4.477,-2.75; 15 -4.477,-3.25; 16 -4.477,-3.75; 33 4.477,-3.75; 34 4.477,-3.25; 35 4.477,-2.75; 36 4.477,-2.25; 37 4.477,-1.75; 38 4.477,-1.25; 39 4.477,-0.75; 40 4.477,-0.25; 41 4.477,0.25; 42 4.477,0.75; 43 4.477,1.25; 44 4.477,1.75; 45 4.477,2.25; 46 4.477,2.75; 47 4.477,3.25; 48 4.477,3.75 | smd 0.25 x 0.55: 17 -3.75,-4.477; 18 -3.25,-4.477; 19 -2.75,-4.477; 20 -2.25,-4.477; 21 -1.75,-4.477; 22 -1.25,-4.477; 23 -0.75,-4.477; 24 -0.25,-4.477; 25 0.25,-4.477; 26 0.75,-4.477; 27 1.25,-4.477; 28 1.75,-4.477; 29 2.25,-4.477; 30 2.75,-4.477; 31 3.25,-4.477; 32 3.75,-4.477; 49 3.75,4.477; 50 3.25,4.477; 51 2.75,4.477; 52 2.25,4.477; 53 1.75,4.477; 54 1.25,4.477; 55 0.75,4.477; 56 0.25,4.477; 57 -0.25,4.477; 58 -0.75,4.477; 59 -1.25,4.477; 60 -1.75,4.477; 61 -2.25,4.477; 62 -2.75,4.477; 63 -3.25,4.477; 64 -3.75,4.477 | smd 7.1 x 7.1: EXP 0,0
2X10 = drill 1.016 octagon: 1 -11.43,-1.27; 2 -11.43,1.27; 3 -8.89,-1.27; 4 -8.89,1.27; 5 -6.35,-1.27; 6 -6.35,1.27; 7 -3.81,-1.27; 8 -3.81,1.27; 9 -1.27,-1.27; 10 -1.27,1.27; 11 1.27,-1.27; 12 1.27,1.27; 13 3.81,-1.27; 14 3.81,1.27; 15 6.35,-1.27; 16 6.35,1.27; 17 8.89,-1.27; 18 8.89,1.27; 19 11.43,-1.27; 20 11.43,1.27
2X03 = drill 1.016 octagon: 1 -2.54,-1.27; 2 -2.54,1.27; 3 0,-1.27; 4 0,1.27; 5 2.54,-1.27; 6 2.54,1.27
USB-MICRO = smd 0.35 x 1.4: D+ 0,2.65; D- -0.65,2.65; GND 1.3,2.65; ID 0.65,2.65; VBUS -1.3,2.65 | smd 1.8 x 1.9: MT1 -4,0; MT2 4,0 | smd 1.9 x 1.9: P$1 -1.27,0; P$2 1.27,0
61400826021 = drill 2.3: 5 -6.57,5.68; 6 -6.57,0; 7 6.57,0; 8 6.57,5.68 | drill 0.9: A1 -3.5,5.33; A2 -1,5.33; A3 1,5.33; A4 3.5,5.33; B1 -3.5,2.71; B2 -1,2.71; B3 1,2.71; B4 3.5,2.71
BOURNS-SRN4018 = smd 1.5 x 3.5: P$1 -1.525,0; P$2 1.525,0
SRP1250A = smd 5 x 3: 1 0,5.5; 2 0,-5.5
LITEON-5630 = smd 1.1 x 1: A1 2.4,-0.65; A2 2.4,0.65; C1 -2.4,-0.65; C2 -2.4,0.65 | smd 2.2 x 1.8: A3 0,0
CHIP-LED0603 = smd 0.8 x 0.8: A 0,-0.75; C 0,0.75
SOT23 = smd 1 x 1.4: 1 -0.95,-1.1; 2 0.95,-1.1; 3 0,1.1
CTS_32X25 = smd 1.2 x 0.9: 1 -1.1,-0.7; 2 1.1,-0.7; 3 1.1,0.8; 4 -1.1,0.8
R0402 = smd 0.7 x 0.9: 1 -0.65,0; 2 0.65,0
MSOP-8EP = smd 0.45 x 1.35: 1 -0.975,-1.975; 2 -0.325,-1.975; 3 0.325,-1.975; 4 0.975,-1.975; 5 0.975,1.975; 6 0.325,1.975; 7 -0.325,1.975; 8 -0.975,1.975 | smd 2 x 1.7: HSINK 0,0
LEAD-QFN24 = smd 0.6 x 0.2: 1 -1.6,1; 2 -1.6,0.6; 3 -1.6,0.2; 4 -1.6,-0.2; 5 -1.6,-0.6; 6 -1.6,-1; 13 1.6,-1; 14 1.6,-0.6; 15 1.6,-0.2; 16 1.6,0.2; 17 1.6,0.6; 18 1.6,1 | smd 0.2 x 0.6: 7 -1,-1.6; 8 -0.6,-1.6; 9 -0.2,-1.6; 10 0.2,-1.6; 11 0.6,-1.6; 12 1,-1.6; 19 1,1.6; 20 0.6,1.6; 21 0.2,1.6; 22 -0.2,1.6; 23 -0.6,1.6; 24 -1,1.6 | smd 1.7 x 1.54: 25 0,0
282836-2 = drill 1.2 pad 2.184 square: CON1 -2.46,0; CON2 2.54,0

### Placement (x,y rotation side)
C1  21.99,16.58 90 top
C2  35.38,43.7 270 bottom
C3  22.1,1.5 180 top
C4  22.1,3.18 180 top
C5  14.37,45.95 180 top
C6  14.37,48.89 180 top
C7  59.1,14.9 0 top
C8  42,38.42 180 top
C9  42,39.91 180 top
C10  59.05,19.05 0 top
C11  47.9,51.6 270 top
C16  27,40.64 0 top
C17  4.09,21.11 180 top
C21  56.52,41.53 0 top
C22  56.52,40.26 0 top
C23  56.52,38.99 0 top
C24  56.52,36.45 0 top
C26  56.52,37.72 0 top
C27  32.66,26.35 90 top
C28  35.72,26.35 90 top
C29  31.9,11.57 270 top
C30  28.42,26.33 270 top
C31  25.87,19.86 0 top
C32  40.42,17.76 180 top
C33  40.42,20.04 180 top
C34  40.42,22.13 180 top
C35  38.62,26.35 270 top
C36  33.14,11.58 90 top
C37  34.41,11.58 90 top
C38  35.8,11.54 90 top
C39  31.39,26.36 270 top
C40  29.37,11.59 90 top
C41  26.81,26.36 270 top
C42  40.42,16.07 180 top
C43  36.97,26.35 270 top
C44  42.4,11.47 270 top
C45  39.79,11.53 90 top
ETHERNET  58.67,38.99 90 bottom
FB1  2.94,19.97 90 bottom
FB2  39.09,29.95 90 top
FB3  37.06,29.95 90 top
FB4  9.67,19.97 90 bottom
H1  61.5,52.5 180 top
H2  3.5,52.5 180 top
H3  61.5,3.5 180 top
H4  3.5,3.5 180 top
IC1  25.75,43.21 90 bottom
IC6  33.04,19 90 bottom
JP1  19.8,52.5 180 bottom
JP2  15.34,33.52 180 bottom
JP3  33.4,4.57 90 bottom
JP4  41.39,52.5 0 top
JP6  52.49,54.5 180 top
K2  58.93,15.88 270 bottom
L1  18.86,47.37 270 top
L3  4.21,33.55 180 bottom
LED1  4,28 90 top
LED2  61,28 90 top
LED3  26.04,6.1 180 top
LED4  29.34,6.1 180 top
LED5  27.69,6.1 180 top
LOGO1  [OHMYDIGIFAB_LOGO]  35.97,42.39 0 top
Q1  18.29,22.91 270 top
Q6  41.1,8.57 0 top
R1  21.99,22.85 270 top
R2  18.31,25.49 180 top
R3  18.31,26.76 0 top
R4  29.34,3.05 270 top
R5  27.69,3.05 270 top
R6  22.99,6.68 270 top
R7  21.72,6.68 270 top
R8  30.62,11.57 90 top
R9  59.1,16.9 0 top
R10  37.18,11.56 90 top
R11  46.5,51.6 270 top
R15  26.04,3.05 270 top
R18  4.09,22.63 0 top
R19  41.11,11.53 270 top
R20  25.87,21.09 180 top
R25  61.85,37.47 0 top
R26  61.85,40.51 0 top
R27  45.85,36.89 0 top
R28  45.85,35.37 0 top
R29  45.85,38.42 0 top
R30  45.85,45.41 0 top
R31  45.85,46.91 0 top
R32  33.89,26.35 90 top
R33  40.41,24.34 0 top
U1  18.29,18.98 90 top
U2  18.28,4.32 0 top
U$1  [TENDA_P200]  11.56,36.07 180 bottom
U$2  6.33,11.28 0 top
U$4  6.33,44.73 180 top

### Tracks (layer width: path | path; a pad name or v marks a point on that pad's centre or on a via)
3V3A  (via drill 0.3, 0.3 pad 0.25, 0.6)
  Top 0.152: v39.2,23.3 39.19,22.7 C34.2
  Top 0.2: 34.4,12.34 C37.2 | C38.2 37.4,13.7 v37.84,13.7 | v41.4,19 41.01,19 C32.2 | v40.1,21 40.1,20.37 C33.2 | C35.2 38.6,24.9 v38.1,24.5
  Top 0.254: C37.2 34.41,13.69 v34.3,13.7 | C36.2 33.14,13.16 v32.6,13.7
  Top 0.406: FB2.1 40.49,29 40.5,29 v40.7,29 | R31.1 43.89,46.91 v43.8,47 | R30.1 43.81,45.41 43.8,45.4 v43.8,45.5 | R29.1 43.88,38.42 v43.8,38.4 43.78,38.42 C8.1 | R27.1 v43.81,36.89 43.8,36.8 v43.8,36.89 | R28.1 43.93,35.37 v43.8,35.4 | C9.1 43.79,39.91 v43.8,39.9
  Route2 0.406: 37.9,13.8 v37.84,13.7
  Route2 0.813: v32.6,13.7 v34.3,13.7 v37.84,13.7 39.1,13.7 41.4,16 v41.4,19 41.4,19.7 v40.1,21 40.1,22.5 v39.2,23.3 39.2,24 38.7,24.5 v38.1,24.5 40.7,27.1 v40.7,29 43.8,32.1 v43.8,35.4 v43.8,36.89 v43.8,38.4 v43.8,39.9 v43.8,45.5 v43.8,47
  Bottom 0.2: IC6.57 40.75,18.75 41,19 v41.4,19 | IC6.64 37.84,14.92 v37.84,13.7 | IC6.54 39.25,20.25 40,21 v40.1,21 | IC6.51 37.85,21.75 38.5,22.4 38.5,22.6 v39.2,23.3 | IC6.49 37.52,24.02 v38.1,24.5
  Bottom 0.254: IC6.10 32.29,14.01 v32.6,13.7 | IC6.5 34.79,14.29 v34.3,13.7
+3V3  (via drill 0.3, 0.3 pad 0.25)
  Top 0.2: U2.13 21.3,3.32 C4.2 21.45,3.95 v21.5,4 | R7.2 R6.2 | U2.22 18.08,6.98 v18.4,7.3 | U2.1 15.92,5.32 15.9,5.3 v15.8,5.3 | U2.8 17.68,2.08 v17.4,1.8 | v31.9,13 31.9,12.8 C29.1 | v32.8,24.5 32.66,24.66 C27.1 | R32.2 33.9,27.11 v33.9,28 | v35.8,24.4 35.72,24.48 C28.1 | C30.2 28.4,25.66 v28.4,23.5 | C31.2 26.96,20 v27.6,20
  Top 0.254: R6.2 23.77,6.03 v23.8,6 | LED3.A 26.04,7.67 v26,7.7 | R26.1 61.2,39.1 | 61.2,39.1 | 61.2,39.1 arc90 v61.3,39 arc90 61.2,38.9 R25.1 | R8.1 30.62,10.02 v30.7,9.9
  Top 0.406: FB2.2 39.1,31.13 v39.1,32 | R20.2 v24.3,21.09 v24.3,21.1
  Route2 0.2: v18.4,7.3 18.4,6.8
  Route2 0.254: v23.8,6 24.1,5.8 24.3,6 | v26,7.7 25.5,7.7
  Bottom 0.2: IC6.39 IC6.40 v32.8,24.5 | v31.9,13 31.9,13.21 31.74,13.37 31.74,14.03 31.79,14.08 IC6.11 | IC6.46 v35.8,24.4 | v28.4,23.5 28.52,23.48 IC6.33 | v27.6,20 27.85,20.25 IC6.27
  Bottom 0.254: IC6.19 27.95,16.25 27.9,16.2 v27.8,16.2
  pour Route2 (rank 6): 65,0 65,56 0,56 0,0
+5V  (via drill 0.3)
  Top 0.406: C6.1 15.91,48.91 v16.5,48.9
  Top 0.61: 58.08,19.38 C10.1 57.88,19.38 K2.B1
  Top 1.27: L1.P$1 17.4,48.9 v16.5,48.9
  other vias: 54.6,51.1 55.4,51.1 54.6,52.2 55.4,52.2
  pour Route2: 6.8,55.5 14.89,55.5 14.89,50.29 53.72,50.29 53.72,52.62 55.8,52.6 55.8,20.82 57.6,20.82 57.6,11.2 48.5,11.2 48.5,47.7 9.47,47.7 9.4,52.5 6.8,52.5
  pour Top: 53.74,52.59 55.75,52.59 55.75,50.77 53.74,50.77
+12V
  Top 0.2: 8.76,44.71 8.77,44.71 U$4.CON1
  Top 0.254: C1.2 22.03,17.23 21.6,16.8 13.09,16.79 11.2,14.9 11.2,10.1 9.8,8.7 2.3,8.7 0.8,9.8 0.8,27.9 1.3,28 LED1.A3
  Top 0.406: 8.76,44.71 8.76,32.51 6.65,30.4 LED1.A1 LED1.A2 4,29.75 LED1.A3 | U1.1 21.2,18 21.9,17.3 C1.2 | C16.1 23.54,40.63 IC1.IN
  pour Bottom: 6.24,47.78 6.24,42.06 -0.11,42.06 -0.11,35.97 8.28,35.97 8.28,37.97 37.61,37.97 37.61,42.93 10.69,42.93 10.69,47.78
AGND
  Top 0.2: JP2.6 17.88,30.46 15.62,28.19 15.62,27.56 6.6,18.41 6.6,13.54 U$2.CON2
  Bottom 0.2: JP2.5 JP2.6
  pour Bottom: 6.75,19.08 12.21,19.08 12.21,9.04 6.75,9.04
AVCC
  Top 0.2: JP2.2 12.8,30.5 15.11,28.19 15.11,27.69 5.97,18.54 5.97,13.5 3.87,11.4 U$2.CON1
  Bottom 0.2: JP2.2 JP2.1
  pour Bottom: 0.02,19.08 5.86,19.08 5.86,9.04 0.02,9.04
AVDD18PLL  (via drill 0.3, 0.3 pad 0.25)
  Top 0.2: C42.2 39.67,15.98 v39,16.05
  Top 0.406: v37.2,32 37.26,31.06 FB3.2
  Route2 0.813: v37.2,32 37.2,31 34.8,28.6 34.8,23.1 36.9,21 36.9,17.1 37.95,16.05 v39,16.05
  Bottom 0.2: IC6.62 38.75,16.25 39,16 v39,16.05
GND  (via drill 0.3, 0.6)
  Top 0.2: 18.03,1.52 18.08,1.57 U2.9 | 18.88,2.2 U2.11 18.88,2.21 18.88,2.2 | 18.88,2.2 18.92,2.16 20.07,2.16 20.19,2.41 v20.32,2.54 20.45,2.54 | U2.20 18.88,6.68 18.9,6.7 19.8,6.7 19.8,5.39 U2.18
  Top 0.254: U1.5 17.32,19.95 U1.HSINK
  other vias: 34.94,19 34.94,17.22 33.04,20.78 33.04,19 33.04,17.22 31.13,19 31.13,17.22 9.4,28.7 15.37,29.21 13.84,27.94 22.35,35.06 16.2,15.8 43.1,19.87 54.94,25.98 47.34,30.73 50.67,35.56 47.22,23.77 59.69,42.42 59.82,35.69 58.42,36.2 58.42,41.78 59.18,38.61 31.94,46.55 43.99,12.65 55.16,3.31 47.09,17.21 54.86,18.03 39.99,37.82 31.14,34.68 38.59,46.57 11.68,30.35 21.39,31.04 35.36,44.09 60.18,47.16 63.88,50.04 63.88,47.12 49.94,47.71 59.05,54.96 57.53,48.28 37.59,52.45 4.83,48.9 1.14,49.66 1.27,43.56 5.33,43.05 2.73,46.94 29.32,28.41 25.12,25.18 1.14,8 3.68,7.24 12.44,6.12 25.38,34.47 6.48,1.14 13.46,1.27 39.41,34.22 51.21,1.46 9.91,1.14 43.19,1.46 8.38,3.81 13.76,18.46 16,8.76 23.52,18.52 23.27,15.47 15.36,21.91 23.5,12.06 25.53,12.45 17.59,28.63 20.57,28 22.09,24.97 51.29,28.99 15.11,3.68 51.03,5.1 37,1.6 23.75,9.02 16.89,1.14 24.65,30.61 24.38,4.83 40.51,42.82 24.64,1.02 28.57,1.4 36.78,5.52 20.95,4.83 30.73,3.3 28.36,14.21 58.93,1.02 49.76,20 57.57,5.25 63.57,13.75 63.67,6.93 56.01,33.02 49.66,33.15 56.77,35.18 63.57,20.39 56.77,42.8 63.56,30.51 14.1,30.48 16.64,30.61 41.91,46.48 9.4,24.38 11.56,25.91 15.88,26.04 43.15,5.1 13.34,10.54 13.34,13.97 10.96,20.59 13.34,23.88 8.26,7.75 15.75,12.32 33.05,29.3 26.65,44.45 32.77,52.58 31.14,20.78 34.94,20.78 28.36,10.21
  pour Top (rank 6): 65,0 65,56 0,56 0,35.94 0,30.86 0,0
  pour Bottom (rank 6): 65,0 65,56 0,56 0,35.94 0,30.86 0,0
  pour Route15 (rank 6): 65,0 65,56 0,56 0,35.94 0,30.86 0,0
LAN_RUN  (via drill 0.3)
  Top 0.2: R8.2 30.59,12.33 v30.59,13.04
  Bottom 0.2: v30.59,13.04 31.29,13.73 IC6.12
LIGHT_PWM  (via drill 0.3)
  Top 0.2: v15.38,43.27 15.4,43.25 15.4,39 17.44,36.96 v19.94,36.96
  Top 0.254: R3.2 18.92,26.8 v18.92,28.01
  Bottom 0.2: v18.92,28.01 18.92,30.86 19.68,31.62 19.68,36.7 v19.94,36.96 | JP1.8 15.38,50.62 v15.38,43.27
N$1
  Top 0.254: LED1.C1 5.15,26.1 7.55,26.1 7.81,26.35 7.81,30.66 9.39,32.25 9.39,35.39 10.3,36.3 40.9,36.3 44.8,32.4 52.36,32.4 55.01,29.75 56.24,29.75 56.88,30.4 60.9,30.4
  Top 0.406: LED1.C2 LED1.C1 | LED2.A2 60.9,30.4 LED2.A1 61,29.37 LED2.A3
N$2
  Top 0.2: LED4.C R4.1
N$3  (via drill 0.3)
  Top 0.254: R18.1 3.43,22.63 v3.43,24.13
  Bottom 0.254: v3.43,24.13 2.94,24.13 FB1.2
  pour Bottom: 0.15,30.63 8.4,30.63 8.4,24.16 5.61,24.16 5.61,20.47 0.02,20.47
N$4
  Top 0.2: U2.10 18.48,1.97 18.8,1.65 21.19,1.65 C3.2
  Top 0.254: C3.2 21.38,1.69
  Top 0.406: 21.38,1.69 21.34,1.65
N$5
  Top 0.254: U1.4 21.99,21.68 R1.2
N$6
  Top 0.254: Q1.3 19.39,22.8 20.09,23.5 R1.1
N$7
  Top 0.254: R3.1 R2.2 17.66,24.33 Q1.1
N$8
  Top 0.2: JP3.3 31.37,4.57 30.35,5.59 30.35,5.83 LED4.A
N$9
  Top 0.254: LED2.C2 57.7,25.6 51.6,31.7 44.5,31.7 40.5,35.7 24.6,35.7 23.7,34.8 23.7,24.02 22.55,22.87 21.18,22.87 20.94,22.63 20.94,21.41 20.04,20.5 15.51,20.5 15.31,20.31 15.31,18.36 15.52,18.15 16.17,18.15 U1.8
  Top 0.406: LED2.C1 LED2.C2
N$10
  pour Top: 14.33,47.12 14.33,44.35 25.55,44.45 25.55,47.12
N$11
  Top 0.2: JP3.4 33.4,5.84 31.5,5.84 30.86,6.48 30.86,7.49 30.48,7.87 28.07,7.87 27.69,7.49 LED5.A
N$12
  Top 0.2: LED5.C R5.1
N$13
  Top 0.2: JP3.2 34.67,1.15 34.16,0.64 26.67,0.64 26.04,1.27 R15.2
N$14
  Top 0.2: LED3.C R15.1
N$19  (via drill 2.2)
  other vias: 46.5,14
N$20  (via drill 2.2)
  other vias: 46.5,42
N$21  (via drill 2.2)
  other vias: 18.5,42
N$22  (via drill 2.2)
  other vias: 18.5,14
N$37
  Top 0.254: R25.2 62.5,37.35 62.36,37.08 62.36,33.58 ETHERNET.12
N$38
  Top 0.254: C17.1 R18.2
N$40
  Top 0.203: 63.05,45.35 ETHERNET.9
  Top 0.254: R26.2 62.5,41.77 61.98,42.29 61.98,44.02 ETHERNET.9
N$41
  Top 0.254: R27.2 47.05,36.89 ETHERNET.4 51.05,38.36 ETHERNET.5 52.08,38.35 54.23,38.35 54.86,37.72 C26.1
N$42  (via drill 0.3)
  Top 0.2: v38.91,15.12 38.4,14.61 38.4,13.37 37.24,12.21 R10.2 37.18,12.35
  Bottom 0.2: IC6.63 37.79,15.75 38.42,15.12 38.86,15.13 v38.91,15.12
N$44  (via drill 0.3)
  Top 0.2: R32.1 33.91,25.69 v33.91,24.56
  Bottom 0.203: v33.91,24.56 33.29,23.84 IC6.41
N$45  (via drill 0.3)
  Top 0.2: R33.1 38.97,24.34 v38.22,23.58
  Bottom 0.2: IC6.50 37.81,22.25 38.12,22.56 38.12,23.3 38.22,23.4 v38.22,23.58
N$46  (via drill 0.3)
  Top 0.2: R20.1 26.71,20.91 v27.61,20.91
  Bottom 0.254: v27.61,20.91 27.79,20.75 IC6.28
NLNKA_LED
  Bottom 0.254: IC6.21 27.35,17.25 27.07,16.97 27.07,10.13 28.1,9.1 35.6,9.1 37.89,6.81 58.5,6.81 58.69,6.8 59,6.8 | 59,6.8 59.19,6.8 | ETHERNET.10 62,41.51 62,31.7 61.99,31.31 61.99,9 59.79,6.8 59,6.8
NSPD_LED
  Bottom 0.254: IC6.22 27.09,17.75 26.56,17.22 26.56,9.94 27.9,8.6 35.4,8.6 37.6,6.4 59.57,6.4 | 59.57,6.4 59.56,6.39 | ETHERNET.11 62.47,33.8 62.47,31.9 62.5,9.37 62.5,8.9 60,6.4 59.57,6.4
PWMA
  Top 0.2: JP1.12 22.16,52.32 31.75,52.32 32.84,51.23 32.89,51.23 33.22,51.23 JP4.1
PWMB
  Top 0.2: JP1.11 22.14,52.7 31.75,52.7 32.82,53.77 33.7,53.77 JP4.2
PWMC
  Bottom 0.2: JP1.14 24.7,52.32 31.73,52.32 32.83,51.23 37.31,51.23 38.33,52.24 40.38,52.24 JP4.3
PWMD
  Bottom 0.2: JP1.15 27.22,52.7 31.74,52.7 32.82,53.77 37.23,53.77 38.3,52.7 42.46,52.7 JP4.5
RX_N
  Top 0.254: R28.2 47.71,35.37 48.07,35.37 ETHERNET.6 54.1,37.09 54.74,36.45 C24.1
  Bottom 0.254: ETHERNET.6 48.51,37.09 47.12,38.48 46.84,38.48 46.15,37.8 46.15,28.2 38.71,20.75 IC6.53
RX_P
  Top 0.254: C23.1 55.24,38.99 53.98,40.26 52.96,40.26 ETHERNET.3 49.03,40.9 46.34,38.22 R29.2
  Bottom 0.254: ETHERNET.3 49.03,40.9 47.12,38.99 46.63,38.99 45.65,38 45.65,28.4 38.49,21.25 IC6.52
TWI_SCL  (via drill 0.3)
  Top 0.2: v12.27,45.15 v12.27,36.91 | U2.23 17.68,7.64 v18.29,8.26 21.08,8.26 21.72,7.62 R7.1
  Bottom 0.2: JP1.6 12.27,49.95 v12.27,45.15 | v12.27,36.91 12.27,36.66 10.54,34.92 10.54,29.84 21.75,18.74 21.75,11.71 v18.29,8.26
TWI_SDA  (via drill 0.3)
  Top 0.2: v11.56,44.45 v11.56,37.51 | U2.24 v17.28,8.25 v17.27,8.26 18.16,9.14 21.97,9.14 22.99,8.13 R6.1
  Bottom 0.2: JP1.4 11.56,50.58 v11.56,44.45 | v11.56,37.51 9.65,35.61 9.65,29.59 21.09,18.16 21.09,12.07 v17.27,8.26
TX_N
  Top 0.254: C22.1 55.24,40.26 53.34,42.17 ETHERNET.2 49.78,42.92 47.3,45.4 R30.2 46.54,45.41
  Bottom 0.254: ETHERNET.2 49.71,42.24 49.47,42.54 48.8,43.2 48.8,44.3 49.46,44.96 53.19,44.96 54.23,43.92 54.23,34.87 48.95,29.6 48.95,28 40.21,19.25 IC6.56
TX_P
  Top 0.254: C21.1 55.24,41.53 53.98,42.8 52.96,42.8 ETHERNET.1 50.08,45.68 48.76,45.68 47.53,46.91 R31.2
  Bottom 0.254: ETHERNET.1 52.13,43.25 49.6,43.24 49.3,43.54 49.3,44.09 49.66,44.45 52.98,44.45 53.72,43.71 53.72,35.08 48.45,29.8 48.45,28.2 39.99,19.75 IC6.55
USB1_SHELL
  pour Top: 50.9,24.6 61.4,24.6 61.4,20 58.9,20 58.9,19.8 58.8,19.8 58.8,11.9 61.4,11.9 61.4,7 50.9,7
USB2_SHELL
  pour Top: 45.6,56 57.9,56 57.9,53 48.8,53 48.8,51.7 45.6,51.7
USB_D_N  (via drill 0.3)
  Top 0.254: JP6.D- 53.15,50.8 53.02,50.67 53.02,50.04 52.38,49.4 51.9,49.4 v51.9,49.22
  Bottom 0.254: IC6.58 37.85,18.25 37.9,18.2 45.02,18.2 49.2,22.38 49.2,23.28 53.4,27.48 53.4,32.73 55.3,34.63 55.3,44.04 55.3,44.31 52.6,47.02 52.6,49.12 52.32,49.4 51.9,49.4 v51.9,49.22
USB_D_P  (via drill 0.3)
  Top 0.254: JP6.D+ 52.49,50.8 52.62,50.67 52.62,50.2 52.22,49.8 51.9,49.8 v51.9,49.98
  Bottom 0.254: IC6.59 37.85,17.75 37.9,17.8 45.18,17.8 49.6,22.22 49.6,23.12 53.8,27.32 53.8,32.56 55.7,34.46 55.7,44.11 55.7,44.31 55.7,44.48 53,47.18 53,49.28 52.48,49.8 51.9,49.8 v51.9,49.98
USBD2_N
  Bottom 0.254: K2.A2 arc-90 52.83,16.1 52.1,16.1 arc90 49.4,13.4 49.4,13.3 arc-90 47.3,11.2 38.6,11.2 arc-90 36.79,13.01 IC6.1
USBD2_P
  Bottom 0.254: 36.29,14.21 IC6.2 36.29,13.11 arc90 38.6,10.8 47.3,10.8 arc90 49.8,13.3 49.8,13.4 arc-90 52.1,15.7 52.78,15.7 arc-90 K2.A3
USBD3_N
  Bottom 0.254: IC6.3 35.79,12.21 arc90 38.4,9.6 48.8,9.6 arc90 50.7,11.5 50.7,11.6 arc-90 52.9,13.8 53.9,13.8 arc90 54.9,14.8 54.9,15.56 arc-90 K2.B2
USBD3_P
  Bottom 0.254: IC6.4 35.29,12.31 arc90 38.4,9.2 48.8,9.2 arc90 51.1,11.5 51.1,11.6 arc-90 52.9,13.4 54.74,13.4 arc90 K2.B3
VDD18CORE  (via drill 0.3)
  Top 0.2: C39.2 31.39,24.81 v31.7,24.5
  Top 0.254: C40.2 v29.36,13.06
  Top 0.406: C41.2 26.81,25.09 v27.4,24.5
  Route2 0.813: v31.7,24.5 v27.4,24.5 25.9,23 25.9,14.8 27.64,13.06 v29.36,13.06
  Bottom 0.2: IC6.38 31.79,24.41 v31.7,24.5
  Bottom 0.254: v29.36,13.06 29.79,13.43 IC6.15
VDD18PLL  (via drill 0.3 pad 0.25)
  Top 0.2: v36.8,24.4 36.8,25.67 C43.2
  Top 0.254: C43.2 37.77,26.4 37.77,28.28 FB3.1
  Bottom 0.2: IC6.48 36.79,24.29 36.8,24.3 v36.8,24.4
XI  (via drill 0.3 pad 0.25)
  Top 0.2: Q6.1 40.01,7.96 40.86,8.82 40.86,10.63 R19.2 41.09,10.88 C45.2 v39.79,13.09 v39.8,13.1
  Bottom 0.2: IC6.61 39.25,16.75 39.8,16.2 v39.8,13.1
XO  (via drill 0.3 pad 0.25)
  Top 0.2: Q6.3 42.4,9.56 C44.2 41.11,12.11 R19.1 v41.11,13.09 v41.1,13.1
  Bottom 0.2: IC6.60 39.55,17.25 41.1,15.7 v41.1,13.1

### Text on the board
tPlace: GND | Picam360 | Interface Board | Rev.0.7 | VCC